# EAGLE schematic InitialVersion (EAGLE 8.6.3)
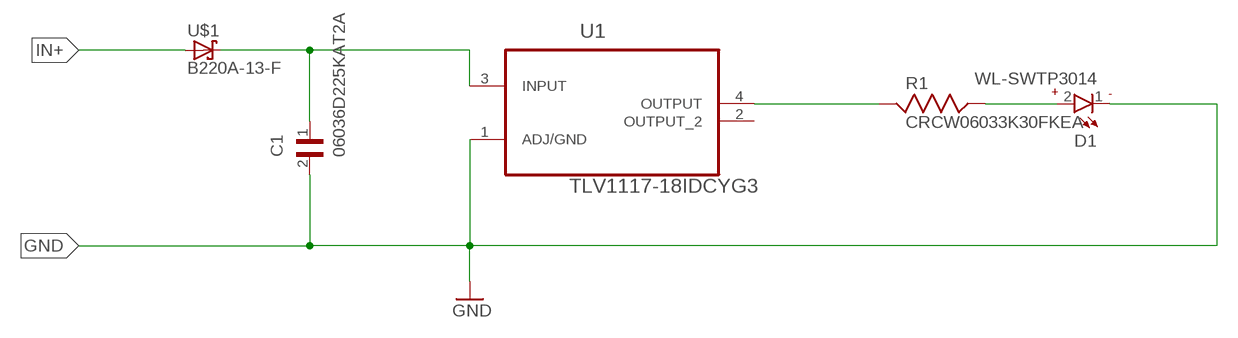
[diagram p0: schematic, sheet 1]

## Parts
C1  06036D225KAT2A  [CAPC1608X90]
D1  WL-SWTP3014  [WL-SWTP_3014]
R1  CRCW06033K30FKEA  [RESC1608X55]
U1  TLV1117-18IDCYG3  [SOT230P700X180-4N]
U$1  B220A-13-F  [SMA-DIODE]

## Nets
GND: C1.2 D1.1 U1.1(ADJ/GND)
IN+: U$1.1(A)
N$1: R1.1 U1.4(OUTPUT)
N$2: D1.2 R1.2
N$4: C1.1 U1.3(INPUT) U$1.2(C)
Unconnected: U1.2(OUTPUT_2)

## Library data of the parts
C1 = Capacitor_2.2uF_0603:06036D225KAT2A: Cap Ceramic 2.2uF 6.3V X5R 10% SMD 0603 85°C Paper T/R; DESCRIPTION: 0603 2.2 uF 6.3 V ±10 % Tolerance X5R Surface Mount Multilayer Ceramic Capacitor; DIGI-KEY_PART_NUMBER: 478-1252-1-ND; DIGI-KEY_PURCHASE_URL: https://www.digikey.co.uk/product-detail/en/avx-corporation/06036D225KAT2A/478-1252-1-ND/564284?utm_source=snapeda&utm_medium=aggregator&utm_campaign=symbol; MF: AVX; MP: 06036D225KAT2A; PACKAGE: 0603 AVX
D1 = WL-SWTP:WL-SWTP: WL-SWTP SMD White Top view PLCC LED Size 3014, PLCC2 Characteristics Fast switching No IR radiation High CRI Slim and miniature size Low power consumption Suitable for all SMT assembly methods Top view Wide viewing angle Various color temperatures Thermal resistance junction to solder point: 38 °K/W LED junction temperature: 130 °C Efficacy typ. 128 Im/W @ 5000 °K Applications Signal lights Indoor displays Backlights General illumination,industrial and commercial lighting systems Replacement for PLCC 3528 in T8/T5 <http://katalog.we-online.de/media/images/eipal/WL-SWTP_pf2.jpg> Details see: http://katalog.we-online.de/en/led/WL-SWTP/158301260?m Creation Date: 2015-01-06, 2015 (C) Wurth Elektronik; DESCRIPTION: SMD LED PLCC2 Daylight white 120 ° 3.2 V Wuerth Elektronik; DIGI-KEY_PART_NUMBER: 732-5661-1-ND; DIGI-KEY_PURCHASE_URL: https://www.digikey.co.uk/product-detail/en/wurth-electronics-inc/158301250/732-5661-1-ND/4947879?utm_source=snapeda&utm_medium=aggregator&utm_campaign=symbol; MF: Wurth Electronics; MP: 158301250; PACKAGE: 1206 Würth Elektronik
R1 = CRCW06033K30FKEA:CRCW06033K30FKEA: Res Thick Film 0603 3.3K Ohm 1% 0.1W(1/10W) ?100ppm/C SMD Automotive Paper T/R; DESCRIPTION: Res Thick Film 0603 3.3K Ohm 1% 0.1W_1/10W_ ?100ppm/C SMD Automotive Paper T/R; DIGI-KEY_PART_NUMBER: 541-3.30KHCT-ND; DIGI-KEY_PURCHASE_URL: https://www.digikey.com/product-detail/en/vishay-dale/CRCW06033K30FKEA/541-3.30KHCT-ND/1179866?utm_source=snapeda&utm_medium=aggregator&utm_campaign=symbol; MF: Vishay Dale; MP: CRCW06033K30FKEA; PACKAGE: 0603 Vishay
U1 = TLV1117-18IDCYG3:TLV1117-18IDCYG3: V REG, LDO, 3.3V, 0.8A; AVAILABILITY: Unavailable; DESCRIPTION: Single Output LDO, 800mA, Fixed and Adj., Internal Current limit, Thermal Overload Protection 4-SOT-223 -40 to 125; MF: Texas Instruments; MP: TLV1117-18IDCYG3; PACKAGE: SOT-223 Texas Instruments; PRICE: None
U$1 = Schottky_0603:B220A-13-F; DESCRIPTION: B220A Series 20 V 2 A Surface Mount Schottky Barrier Rectifier - SMA; DIGI-KEY_PART_NUMBER: B220A-FDICT-ND; DIGI-KEY_PURCHASE_URL: https://www.digikey.co.uk/product-detail/en/diodes-incorporated/B220A-13-F/B220A-FDICT-ND/751528?utm_source=snapeda&utm_medium=aggregator&utm_campaign=symbol; MF: Diodes Inc.; MP: B220A-13-F; PACKAGE: DO-214 Diodes Inc.